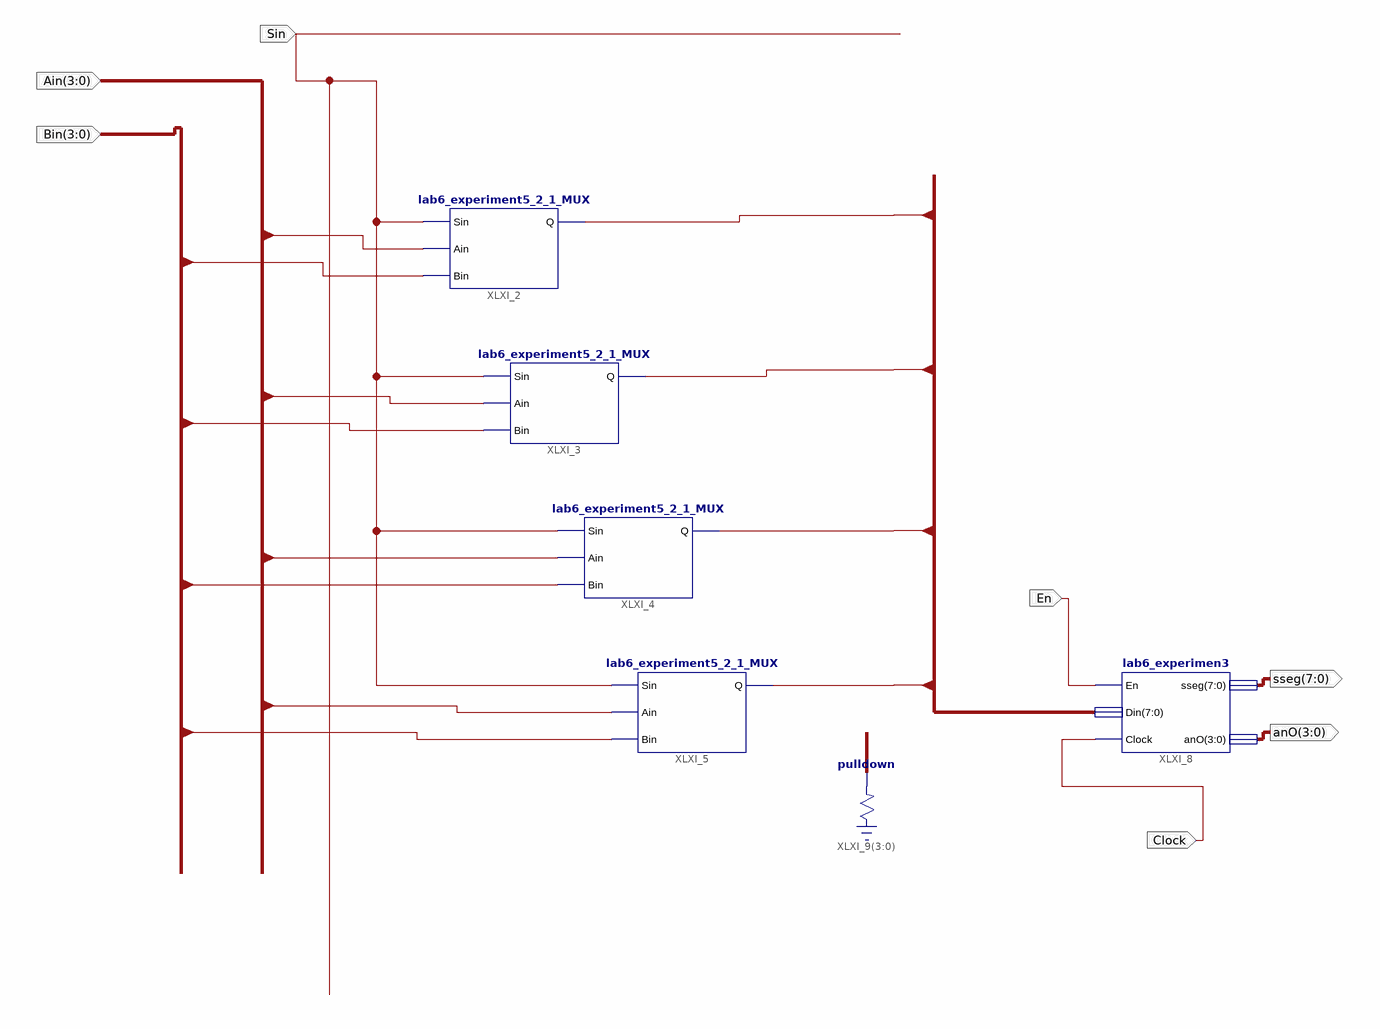
[diagram p0: schematic sheet 1]
// Xilinx ISE schematic lab6_experiment5_4_MUX.sch (spartan3e) as structural Verilog: 6 symbols, 7 ports
module lab6_experiment5_4_MUX (
  input  [3:0] Bin,
  input  [3:0] Ain,
  input  Sin,
  input  En,
  input  Clock,
  output [7:0] sseg,
  output [3:0] anO
);

  wire [7:0] Din;

  lab6_experiment5_2_1_MUX XLXI_2 (.Sin(Sin), .Ain(Ain[0]), .Bin(Bin[0]), .Q(Din[0]));
  lab6_experiment5_2_1_MUX XLXI_3 (.Sin(Sin), .Ain(Ain[1]), .Bin(Bin[1]), .Q(Din[1]));
  lab6_experiment5_2_1_MUX XLXI_4 (.Sin(Sin), .Ain(Ain[2]), .Bin(Bin[2]), .Q(Din[2]));
  lab6_experiment5_2_1_MUX XLXI_5 (.Sin(Sin), .Ain(Ain[3]), .Bin(Bin[3]), .Q(Din[3]));
  lab6_experimen3 XLXI_8 (.En(En), .Din(Din), .Clock(Clock), .sseg(sseg), .anO(anO));
  \pulldown  XLXI_9[3:0] (.O(Din[7:4]));
endmodule
